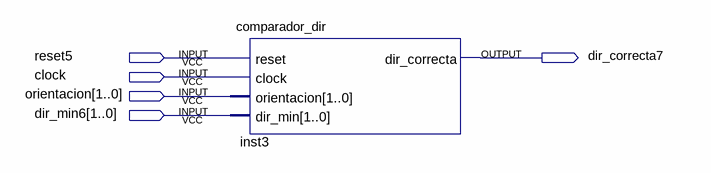
[diagram p0: schematic sheet]
// Quartus schematic prueba_comparador_dir.bdf as structural Verilog: 1 symbols, 5 pins
module prueba_comparador_dir (
  input  reset5,
  input  clock,
  input  [1:0] orientacion,
  input  [1:0] dir_min6,
  output dir_correcta7
);

  comparador_dir inst3 (
    .reset(reset5), .clock(clock), .orientacion(orientacion), .dir_min(dir_min6), .dir_correcta(dir_correcta7));
endmodule
